# EAGLE design PCB-AC2 (EAGLE 7.7.0)

## Sheet 1 of 2
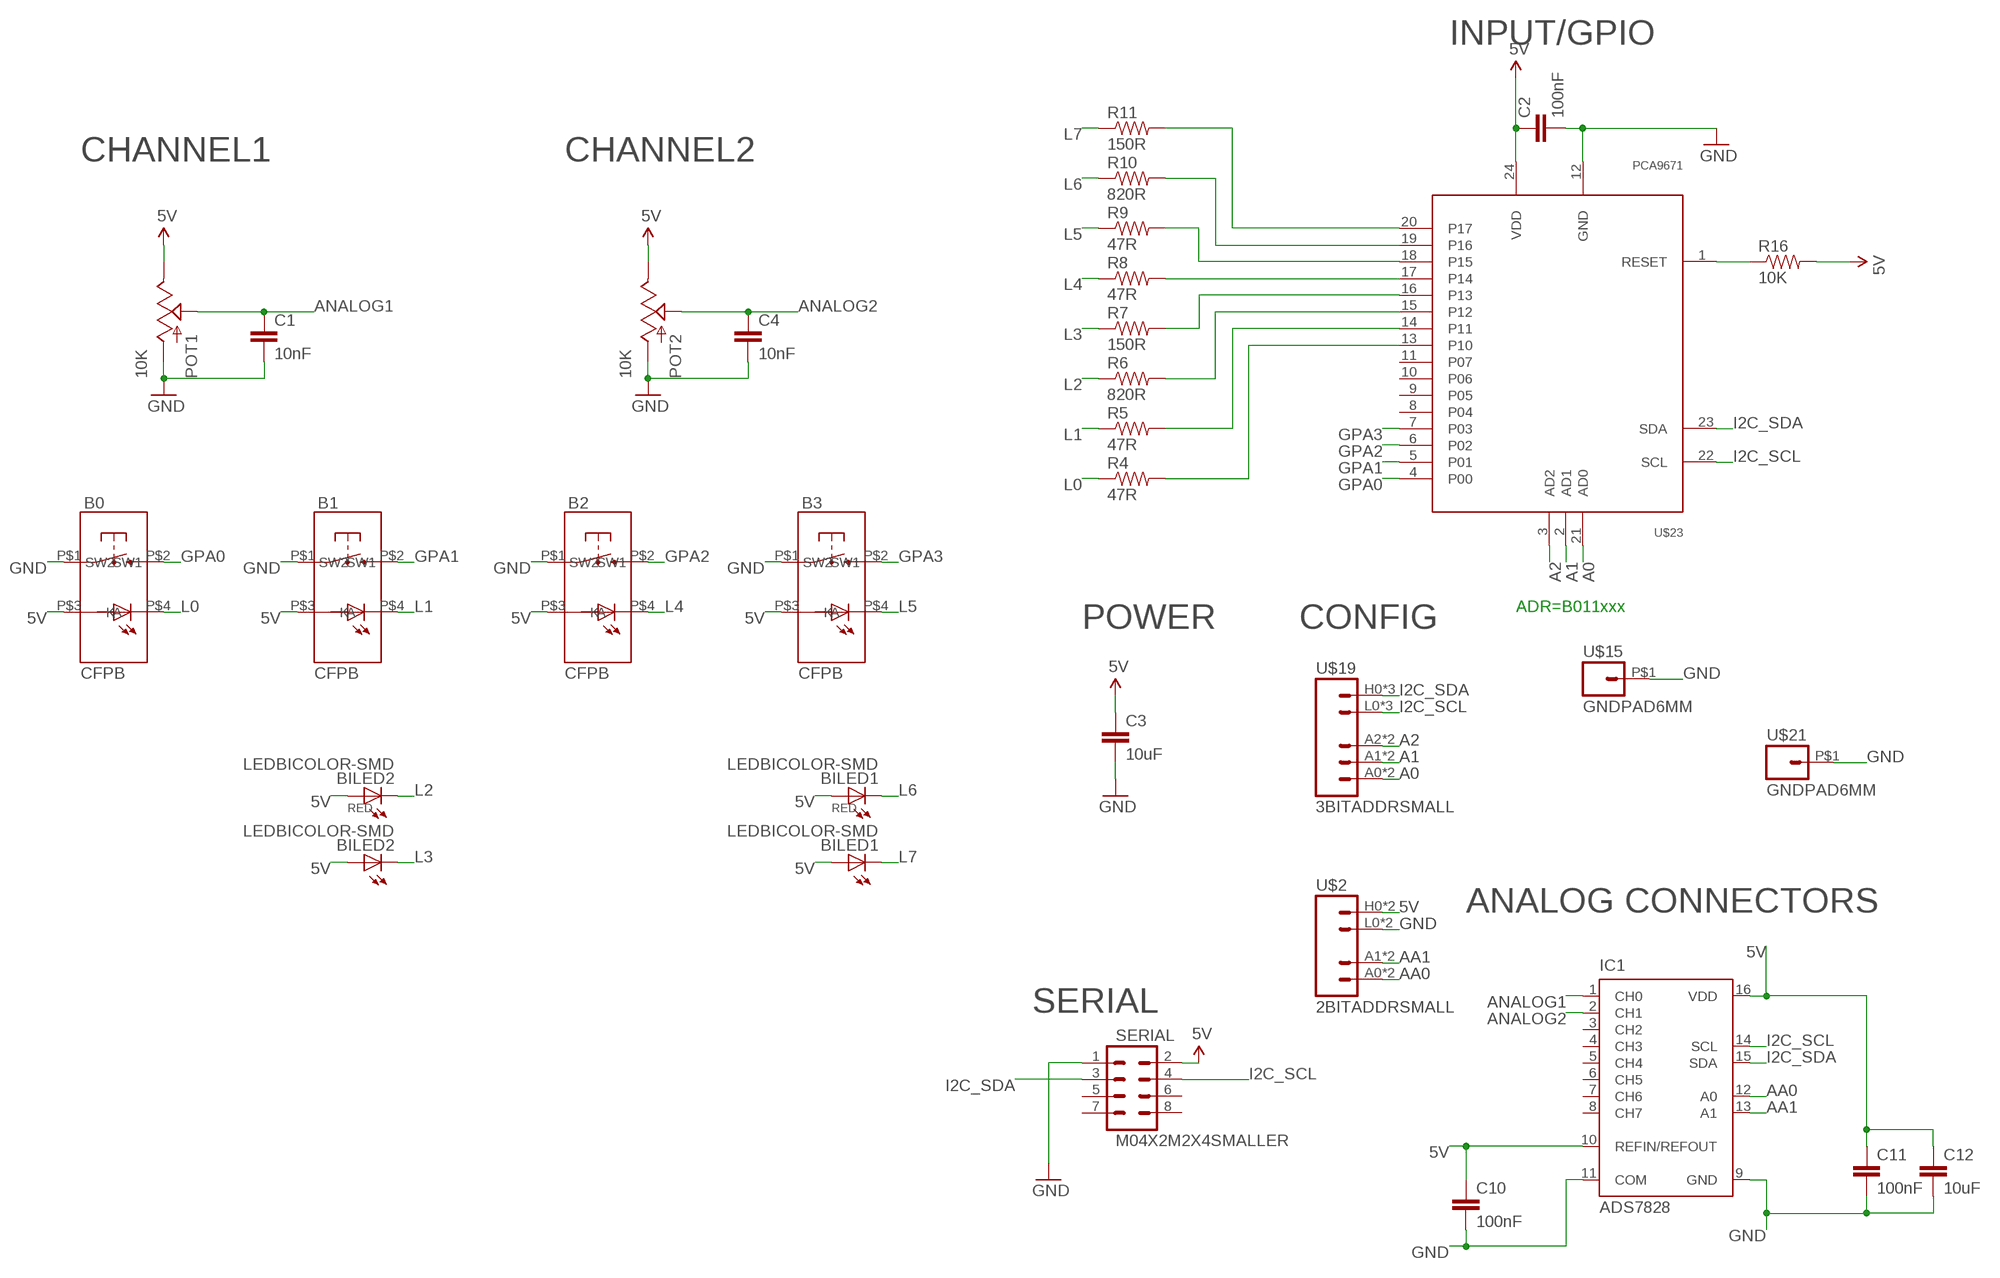
[diagram p0: schematic, sheet 1]

### Parts
B0  CFPB  [CFPB-6/9MM]
B1  CFPB  [CFPB-6/9MM]
B2  CFPB  [CFPB-6/9MM]
B3  CFPB  [CFPB-6/9MM]
BILED1  LEDBICOLOR-SMD  [LEDBICOLOR-SMD]
BILED2  LEDBICOLOR-SMD  [LEDBICOLOR-SMD]
C1  10nF  CAP0603-CAP  [0603-CAP]
C2  100nF  CAP0603-CAP  [0603-CAP]
C3  10uF  CAP0805  [0805]
C4  10nF  CAP0603-CAP  [0603-CAP]
C10  100nF  CAP0603-CAP  [0603-CAP]
C11  100nF  CAP0603-CAP  [0603-CAP]
C12  10uF  CAP0805  [0805]
IC1  ADS7828  [TSSOP16-PW]
POT1  10K  POT  [ALPS_POT]
POT2  10K  POT  [ALPS_POT]
R4  47R  RESISTOR0603-RES  [0603-RES]
R5  47R  RESISTOR0603-RES  [0603-RES]
R6  820R  RESISTOR0603-RES  [0603-RES]
R7  150R  RESISTOR0603-RES  [0603-RES]
R8  47R  RESISTOR0603-RES  [0603-RES]
R9  47R  RESISTOR0603-RES  [0603-RES]
R10  820R  RESISTOR0603-RES  [0603-RES]
R11  150R  RESISTOR0603-RES  [0603-RES]
R16  10K  RESISTOR0603-RES  [0603-RES]
SERIAL  M04X2M2X4SMALLER  [M2X4SMALLER]
U$2  2BITADDRSMALL  [2BITADDR_SMALL]
U$15  GNDPAD6MM  [3.2MMPAD6MM]
U$19  3BITADDRSMALL  [3BITADDR_SMALL]
U$21  GNDPAD6MM  [3.2MMPAD6MM]
U$23  PCA9671  [TSSOP24]

### Nets
5V [Power]: B0.P$3(A) B1.P$3(A) B2.P$3(A) B3.P$3(A) BILED1.P$1(A) BILED1.P$3(A1) BILED2.P$1(A) BILED2.P$3(A1) C2.1 C3.1 C10.1 C11.1 C12.1 IC1.10(REFIN/REFOUT) IC1.16(VDD) POT1.P$1(E) POT2.P$1(E) R16.2 SERIAL.2 U$2.H0(VCC) U$2.H1(VCC) U$23.24(VDD)
A0: U$19.A0 U$19.AS0(A0) U$23.21(AD0)
A1: U$19.A1 U$19.AS1(A1) U$23.2(AD1)
A2: U$19.A2 U$19.AS2(A2) U$23.3(AD2)
AA0: IC1.12(A0) U$2.A0(A1) U$2.AS0(A1)
AA1: IC1.13(A1) U$2.A1(A2) U$2.AS1(A2)
ANALOG1: C1.1 IC1.1(CH0) POT1.P$2(S)
ANALOG2: C4.1 IC1.2(CH1) POT2.P$2(S)
GND [Power]: B0.P$1(SW1) B1.P$1(SW1) B2.P$1(SW1) B3.P$1(SW1) C1.2 C2.2 C3.2 C4.2 C10.2 C11.2 C12.2 IC1.9(GND) IC1.11(COM) POT1.P$3(A) POT2.P$3(A) SERIAL.1 U$2.L0(GND) U$2.L1(GND) U$15.P$1 U$21.P$1 U$23.12(GND)
GPA0: B0.P$2(SW2) U$23.4(P00)
GPA1: B1.P$2(SW2) U$23.5(P01)
GPA2: B2.P$2(SW2) U$23.6(P02)
GPA3: B3.P$2(SW2) U$23.7(P03)
I2C_SCL: IC1.14(SCL) SERIAL.4 U$19.L0(GND) U$19.L1(GND) U$19.L2(GND) U$23.22(SCL)
I2C_SDA: IC1.15(SDA) SERIAL.3 U$19.H0(VCC) U$19.H1(VCC) U$19.H2(VCC) U$23.23(SDA)
L0: B0.P$4(K) R4.1
L1: B1.P$4(K) R5.1
L2: BILED2.P$2(C) R6.1
L3: BILED2.P$4(C1) R7.1
L4: B2.P$4(K) R8.1
L5: B3.P$4(K) R9.1
L6: BILED1.P$2(C) R10.1
L7: BILED1.P$4(C1) R11.1
N$2: R7.2 U$23.16(P13)
N$3: R8.2 U$23.17(P14)
N$4: R9.2 U$23.18(P15)
N$5: R10.2 U$23.19(P16)
N$6: R11.2 U$23.20(P17)
N$7: R6.2 U$23.15(P12)
N$8: R5.2 U$23.14(P11)
N$9: R4.2 U$23.13(P10)
N$22: R16.1 U$23.1(RESET)
Unconnected: IC1.3(CH2) IC1.4(CH3) IC1.5(CH4) IC1.6(CH5) IC1.7(CH6) IC1.8(CH7) SERIAL.5 SERIAL.6 SERIAL.7 SERIAL.8 U$23.8(P04) U$23.9(P05) U$23.10(P06) U$23.11(P07)

### Notes on the sheet
- INPUT/GPIO
- CHANNEL1 | CHANNEL2
- ADR=B011xxx
- POWER | CONFIG
- ANALOG CONNECTORS
- SERIAL

## Sheet 2 of 2

## Library data of the parts
B0 B1-B3 = SKAARHOJ:CFPB
BILED1 BILED2 = SKAARHOJ:LEDBICOLOR-SMD
C1-C4 C10-C12 = SparkFun:CAP: Capacitor Standard 0603 ceramic capacitor, and 0.1" leaded capacitor.
IC1 = burr-brown:ADS7828: 12-Bit, 8-Channel Sampling ANALOG-TO-DIGITAL CONVERTER with I2C? Interface Source: www.ti.com .. ADS7828.pdf; MF: TEXAS INSTRUMENTS; MPN: ADS7828E/250; OC_FARNELL: 1470338; OC_NEWARK: 74C7158
POT1 POT2 = SparkFun:POT
R4-R11 R16 = SparkFun:RESISTOR: Resistor Basic schematic elements and footprints for 0603, 1206, and PTH resistors.
SERIAL = SKAARHOJ:M04X2
U$2 = SKAARHOJ:2BITADDR
U$15 U$21 = SKAARHOJ:GNDPAD
U$19 = SKAARHOJ:3BITADDR
U$23 = SKAARHOJ:PCA9671

## Net classes
0 default: width 0.203 mm, drill 0.406 mm, clearance 0.203 mm
1 Power: width 0.406 mm, drill 0.61 mm, clearance 0.203 mm
2 Signal: width 0.152 mm, clearance 0.152 mm

## Board
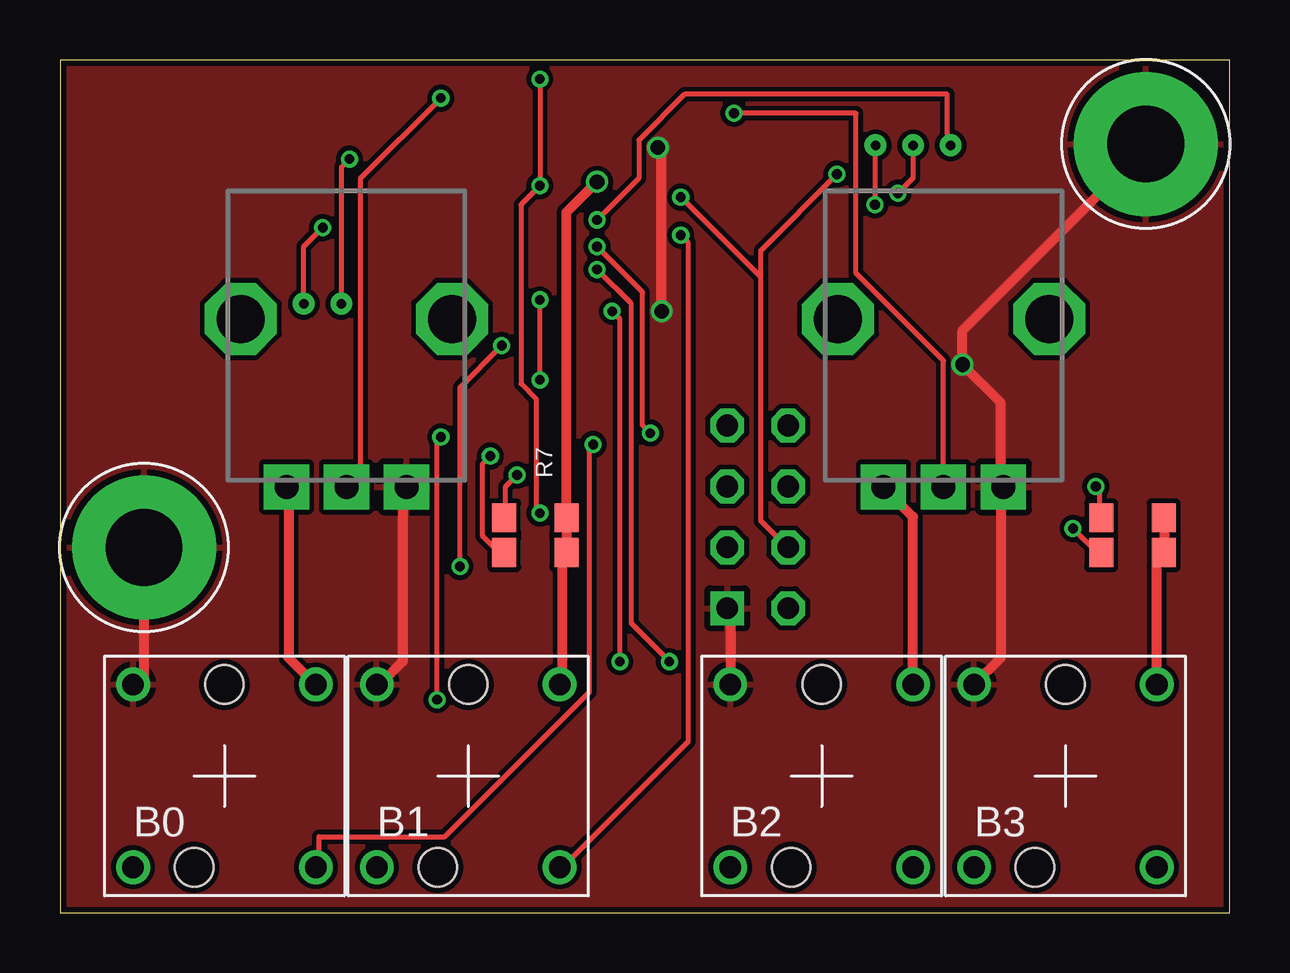
[diagram p1: board, top side]
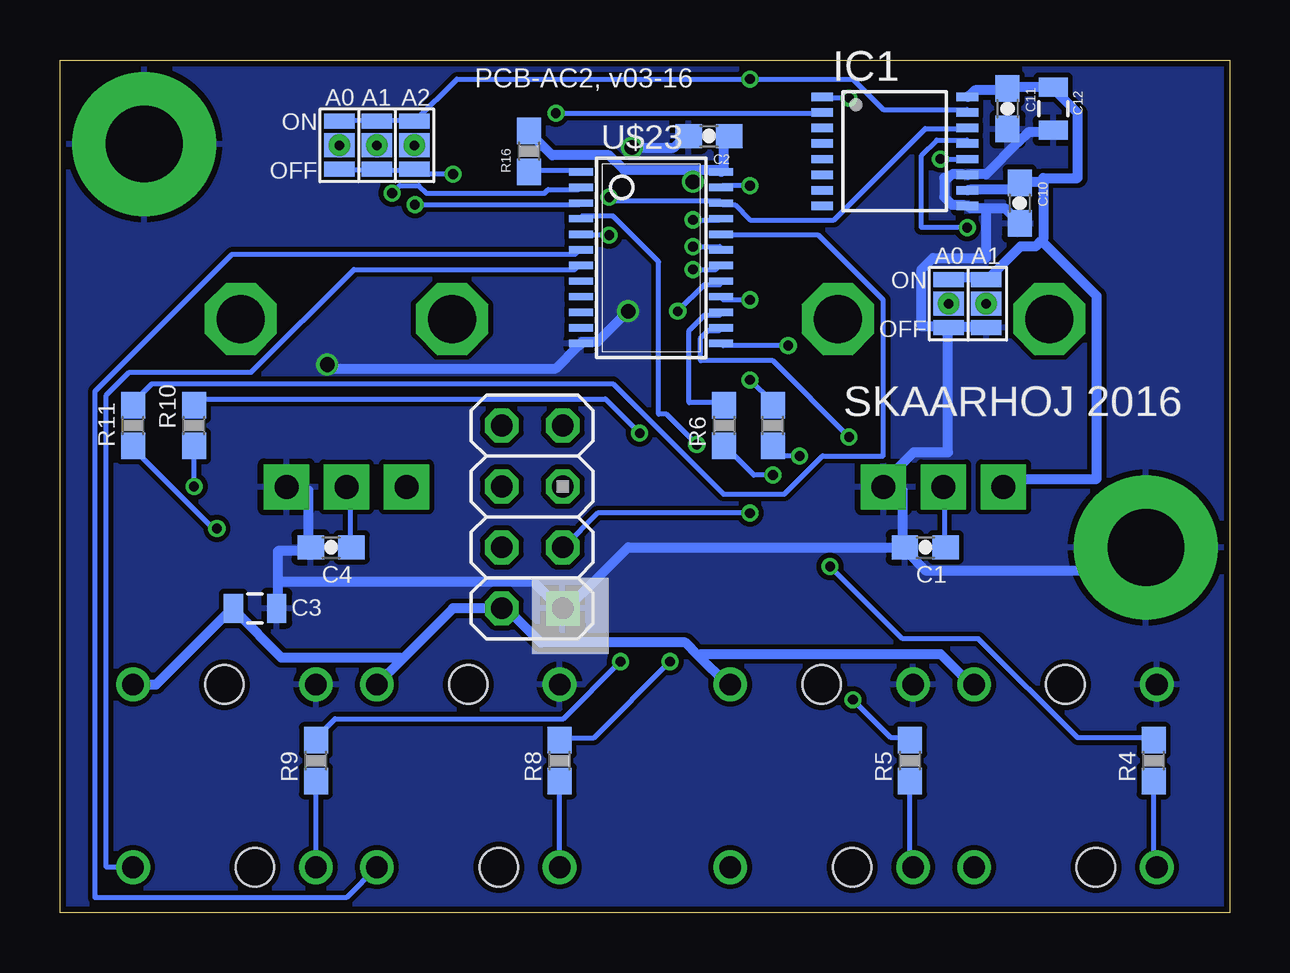
[diagram p2: board, bottom side, seen from below]

Size 48.77 x 35.56 mm. Coordinates in mm from the lower left corner, seen from the top.
Outline: 0,0 48.77,0 48.77,35.56 0,35.56 0,0
Copper layers (1*16): Top 0.035mm / dielectric 1.5mm / Bottom 0.035mm
Design rules "Fusion_eagle_rule_v1.1": minimum track width 6mil, minimum drill 12mil, track to track 6mil, track to pad 6mil, pad to pad 6mil, via to via 6mil, smd to smd 0mil, copper to edge 10mil, drill to drill 10mil, minimum pad ring 10mil, minimum via ring 6mil, stop-mask expansion 2mil, vias tented up to drill 100mil, thermal gap 10mil

### Footprints (pad centres in the part's own frame; a part is rotated, then mirrored left to right if it is on the bottom)
CFPB-6/9MM = drill 0.9: P$1 -3.81,3.81; P$2 3.81,-3.81; P$3 3.81,3.81; P$4 -3.81,-3.81 | hole 1.6: 0,3.81; -1.27,-3.81
LEDBICOLOR-SMD = smd 1 x 1.2: P$1 1.3,0.725; P$2 -1.3,0.725; P$3 1.3,-0.725; P$4 -1.3,-0.725
0603-CAP = smd 1.1 x 1: 1 -0.85,0; 2 0.85,0
0805 = smd 0.8 x 1.2: 1 -0.9,0; 2 0.9,0
TSSOP16-PW = smd 0.35 x 0.9: 1 -2.275,-3.025; 2 -1.625,-3.025; 3 -0.975,-3.025; 4 -0.325,-3.025; 5 0.325,-3.025; 6 0.975,-3.025; 7 1.625,-3.025; 8 2.275,-3.025; 9 2.275,3.025; 10 1.625,3.025; 11 0.975,3.025; 12 0.325,3.025; 13 -0.325,3.025; 14 -0.975,3.025; 15 -1.625,3.025; 16 -2.275,3.025
ALPS_POT = drill 1 pad 1.88 square: P$1 7,-2.5; P$2 7,0; P$3 7,2.5 | drill 2 octagon: P$4 0,-4.4; P$5 0,4.4
0603-RES = smd 1.1 x 1: 1 -0.85,0; 2 0.85,0
M2X4SMALLER = drill 0.9 square: 1 -1.27,3.81 | drill 0.9 octagon: 2 1.27,3.81; 3 -1.27,1.27; 4 1.27,1.27; 5 -1.27,-1.27; 6 1.27,-1.27; 7 -1.27,-3.81; 8 1.27,-3.81
2BITADDR_SMALL = drill 0.4: A0 -1.565,0; A1 0,0 | smd 1.27 x 1: AS0 -1.565,0; AS1 0,0 | smd 1.27 x 0.635: H0 -1.565,1; H1 0,1; L0 -1.565,-1; L1 0,-1
3.2MMPAD6MM = drill 3.2 pad 6: P$1 0,0
3BITADDR_SMALL = drill 0.4: A0 -1.565,0; A1 0,0; A2 1.565,0 | smd 1.27 x 1: AS0 -1.565,0; AS1 0,0; AS2 1.565,0 | smd 1.27 x 0.635: H0 -1.565,1; H1 0,1; H2 1.565,1; L0 -1.565,-1; L1 0,-1; L2 1.565,-1
TSSOP24 = smd 0.305 x 0.991: 1 -4.225,-2.918; 2 -3.575,-2.918; 3 -2.925,-2.918; 4 -2.275,-2.918; 5 -1.625,-2.918; 6 -0.975,-2.918; 7 -0.325,-2.918; 8 0.325,-2.918; 9 0.975,-2.918; 10 1.625,-2.918; 11 2.275,-2.918; 12 2.925,-2.918; 13 2.925,2.918; 14 2.275,2.918; 15 1.625,2.918; 16 0.975,2.918; 17 0.325,2.918; 18 -0.325,2.918; 19 -0.975,2.918; 20 -1.625,2.918; 21 -2.275,2.918; 22 -2.925,2.918; 23 -3.575,2.918; 24 -4.225,2.918

### Placement (x,y rotation side)
B0  6.86,5.71 0 top
B1  17.02,5.71 0 top
B2  31.75,5.71 0 top
B3  41.91,5.71 0 top
BILED1  44.7,15.75 0 top
BILED2  19.81,15.75 0 top
C1  12.7,15.24 180 bottom
C2  21.72,32.38 180 bottom
C3  40.64,12.7 0 bottom
C4  37.47,15.24 180 bottom
C10  8.76,29.59 270 bottom
C11  9.27,33.53 270 bottom
C12  7.37,33.53 270 bottom
IC1  13.97,31.75 270 bottom
POT1  11.94,24.77 270 top
POT2  36.83,24.77 270 top
R4  3.17,6.35 90 bottom
R5  13.34,6.35 90 bottom
R6  21.08,20.32 90 bottom
R7  19.05,20.32 90 bottom
R8  27.94,6.35 90 bottom
R9  38.1,6.35 90 bottom
R10  43.18,20.32 90 bottom
R11  45.72,20.32 90 bottom
R16  29.21,31.75 90 bottom
SERIAL  29.08,16.51 180 bottom
U$2  10.16,25.4 0 bottom
U$15  3.5,15.24 0 top
U$19  35.56,32 0 bottom
U$21  45.26,32.06 0 top
U$23  24.13,26.67 270 bottom

### Tracks (layer width: path | path; a pad name or v marks a point on that pad's centre or on a via)
5V  (via drill 0.61)
  Top 0.406: B0.P$3 10.64,9.53 9.53,10.64 9.53,17.62 POT1.P$1 | BILED1.P$1 46.04,16.35 46.04,15.08 BILED1.P$3 45.88,14.92 45.72,14.76 B3.P$3 | B2.P$3 35.56,16.51 34.45,17.62 POT2.P$1 | B1.P$3 20.95,9.53 20.95,14.92 BILED2.P$3 21.11,15.08 21.11,16.35 BILED2.P$1 21.11,16.67 21.11,29.21 v22.38,30.48
  Bottom 0.406: IC1.16 10.79,34.13 10.64,34.29 9.37,34.29 C11.1 9.21,34.45 7.46,34.45 C12.1 7.3,34.29 6.35,33.34 6.35,30.64 7.78,30.64 7.78,30.48 | U$2.H0 11.59,26.51 10.16,26.51 U$2.H1 10,26.51 8.73,27.78 8.1,27.78 7.86,28.02 | IC1.10 10.79,30.16 9.05,30.16 8.89,30.32 C10.1 8.57,30.48 7.78,30.48 | 7.86,28.02 7.78,28.1 7.78,30.48 | 7.86,28.02 5.56,25.72 5.56,18.1 9.05,18.1 9.37,17.78 POT1.P$1 | B3.P$3 44.77,9.53 41.59,12.7 C3.1 41.43,12.54 39.53,10.64 34.61,10.64 34.53,10.56 | 34.53,10.56 32.38,12.7 SERIAL.2 30.16,12.7 28.73,11.27 22.7,11.27 22.15,10.72 | 34.53,10.56 B2.P$3 | C2.1 21.11,32.38 21.11,30.96 U$23.24 21.27,30.96 22.38,30.96 | 22.38,30.96 25.24,30.96 25.88,31.59 28.26,31.59 29.21,32.54 R16.2 | v22.38,30.48 22.38,30.96 | 22.15,10.72 20.95,9.53 B1.P$3 | B0.P$3 10.79,9.53 12.06,10.79 22.07,10.79 22.15,10.72
A0  (via drill 0.41)
  Top 0.203: v22.38,28.89 24.13,30.64 24.13,32.23 26.04,34.13 36.99,34.13 36.99,32.07 U$19.AS0
  Bottom 0.203: v22.38,28.89 21.27,28.89 U$23.21 | 37.15,32.07 U$19.AS0
A1  (via drill 0.41)
  Top 0.203: v34.92,30 35.56,30.64 U$19.AS1
  Bottom 0.203: v34.92,30 34.61,30.32 33.81,30.32 33.5,30 28.57,30 28.42,30.16 27.15,30.16 U$23.2 | 35.56,32.07 U$19.AS1
A2  (via drill 0.41)
  Top 0.203: v33.97,29.53 33.97,31.91 U$19.AS2
  Bottom 0.203: v33.97,29.53 27.15,29.53 U$23.3 | 34.13,32.07 U$19.AS2
AA0  (via drill 0.41)
  Top 0.203: v12.06,31.43 11.75,31.11 11.75,25.4 U$2.A0
  Bottom 0.203: v12.06,31.43 IC1.12 | 11.75,25.4 U$2.A0
AA1  (via drill 0.41)
  Top 0.203: v10.95,28.57 10.16,27.78 U$2.A1
  Bottom 0.203: v10.95,28.57 12.86,28.57 12.86,31.59 12.22,32.23 10.95,32.23 IC1.13
ANALOG1  (via drill 0.41)
  Top 0.203: v15.88,33.97 12.54,30.64 12.54,18.26 12.06,17.78 POT1.P$2
  Bottom 0.203: v15.88,33.97 16.99,33.97 IC1.1 | C1.1 11.91,15.24 11.91,17.62 POT1.P$2
ANALOG2  (via drill 0.41)
  Top 0.203: v28.1,33.34 33.18,33.34 33.18,26.67 36.83,23.02 POT2.P$2
  Bottom 0.203: v28.1,33.34 17.14,33.34 IC1.2 | C4.1 36.67,15.24 36.67,17.62 36.83,17.62 POT2.P$2
GND  (via drill 0.61)
  Top 0.406: B0.P$1 3.17,9.53 3.49,9.84 U$15.P$1 | B1.P$1 13.34,9.53 14.29,10.48 14.29,17.62 POT1.P$3 | B2.P$1 27.94,12.7 SERIAL.1 | v24.92,31.91 25.08,31.75 v25.08,25.08 | B3.P$1 39.21,10.64 39.21,17.62 POT2.P$3 39.21,17.78 39.21,21.27 v37.62,22.86 37.62,24.29 45.24,31.91 U$21.P$1
  Bottom 0.406: 10.16,29.37 9.37,29.37 8.89,28.89 C10.2 | 10.16,29.37 10.79,29.37 IC1.9 11.11,29.53 11.59,29.53 11.91,29.84 11.91,30.64 11.75,30.64 11.59,30.8 11.11,30.8 IC1.11 10.79,30.8 10.16,30.8 8.81,32.15 | 8.81,32.15 8.41,32.54 7.46,32.54 C12.2 | 8.81,32.15 9.21,32.54 C11.2 | U$2.L1 10.16,24.45 11.59,24.45 U$2.L0 | C1.2 13.65,15.24 13.65,17.62 14.29,17.62 POT1.P$3 14.45,17.94 13.18,19.21 11.75,19.21 11.75,24.29 U$2.L0 | 10.16,29.37 10.16,27.3 12.38,27.3 12.86,26.83 12.86,24.45 11.91,24.45 U$2.L0 | U$15.P$1 3.65,15.24 4.6,14.29 12.7,14.29 13.49,15.08 C1.2 | v37.62,22.86 37.47,22.7 28.1,22.7 27.15,23.65 U$23.12 26.99,23.81 26.35,23.81 v25.08,25.08 | POT2.P$3 39.21,17.62 38.42,17.62 38.42,15.24 C4.2 38.42,15.08 39.69,15.08 39.69,13.81 | v24.92,31.91 23.18,31.91 22.7,32.38 C2.2 | 39.69,13.81 39.69,12.7 C3.2 | 39.69,13.81 29.05,13.81 27.94,12.7 SERIAL.1 27.62,12.7 25.08,15.24 C1.2
  pour Top: 0,0 49.53,0 49.53,35.56 0,35.56
  pour Bottom: 0,0 49.53,0 49.53,35.56 0,35.56
GPA0  (via drill 0.41)
  Top 0.203: v22.23,19.53 22.07,19.37 22.07,9.21 16.03,3.17 10.79,3.17 10.79,1.91 B0.P$2
  Bottom 0.203: v22.23,19.53 23.5,20.8 23.81,20.8 23.81,27.15 25.72,29.05 26.99,29.05 U$23.4
GPA1  (via drill 0.41)
  Top 0.203: v25.88,28.26 26.19,27.94 26.19,7.14 20.95,1.91 B1.P$2
  Bottom 0.203: v25.88,28.26 26.99,28.26 U$23.5
GPA2
  Bottom 0.203: B2.P$2 36.83,0.64 47.31,0.64 47.31,21.75 41.59,27.46 27.3,27.46 27.15,27.62 U$23.6
GPA3
  Bottom 0.203: B3.P$2 46.83,1.91 46.83,21.59 45.88,22.54 40.8,22.54 36.51,26.83 27.3,26.83 27.15,26.99 U$23.7
I2C_SCL  (via drill 0.41)
  Top 0.203: v32.38,30.8 29.21,27.62 29.21,26.51 | 29.21,26.51 29.21,16.35 30.32,15.24 SERIAL.4 | 29.21,26.51 v25.88,29.84
  Bottom 0.203: IC1.14 10.95,32.7 12.7,32.7 16.51,28.89 20,28.89 20.64,29.53 21.11,29.53 U$23.22 21.27,29.69 25.72,29.69 v25.88,29.84 | 35.56,30.96 34.13,30.96 U$19.L2 33.97,30.96 33.81,30.8 v32.38,30.8 | 35.56,30.96 36.99,30.96 U$19.L0 | 35.56,30.96 U$19.L1
I2C_SDA  (via drill 0.41)
  Top 0.203: v20,34.77 v20,30.32 19.21,29.53 19.21,22.07 19.84,21.43 19.84,16.83 v20,16.67
  Bottom 0.203: IC1.15 10.95,33.5 14.45,33.5 15.72,34.77 v20,34.77 32.23,34.77 33.97,33.02 U$19.H2 34.13,33.02 35.56,33.02 | v20,30.32 21.11,30.32 U$23.23 | 35.56,33.02 36.99,33.02 U$19.H0 | 35.56,33.02 U$19.H1 | v20,16.67 26.35,16.67 27.78,15.24 SERIAL.3
L0
  Bottom 0.203: R4.1 3.17,1.91 B0.P$4
L1
  Bottom 0.203: R5.1 13.34,1.91 B1.P$4
L2  (via drill 0.41)
  Top 0.203: v19.05,18.26 18.57,17.78 18.57,16.51 BILED2.P$2
  Bottom 0.203: v19.05,18.26 19.84,18.26 20.95,19.37 R6.1
L3  (via drill 0.41)
  Top 0.203: v17.94,19.05 17.62,18.73 17.62,15.72 18.41,14.92 BILED2.P$4
  Bottom 0.203: v17.94,19.05 18.73,19.05 19.05,19.37 R7.1
L4
  Bottom 0.203: B2.P$4 R8.1
L5
  Bottom 0.203: B3.P$4 R9.1
L6  (via drill 0.41)
  Top 0.203: v43.18,17.78 43.34,17.62 43.34,16.51 BILED1.P$2
  Bottom 0.203: v43.18,17.78 R10.1
L7  (via drill 0.41)
  Top 0.203: v42.23,16.03 43.34,14.92 BILED1.P$4
  Bottom 0.203: v42.23,16.03 42.39,16.03 45.72,19.37 R11.1
N$2  (via drill 0.41)
  Top 0.203: v20,22.23 v20,25.56
  Bottom 0.203: v20,25.56 21.11,25.56 U$23.16 | v20,22.23 19.05,21.27 R7.2
N$3  (via drill 0.41)
  Top 0.203: v23.02,25.08 23.34,24.77 v23.34,10.48
  Bottom 0.203: v23.02,25.08 21.91,26.19 21.27,26.19 U$23.17 | v23.34,10.48 26.51,7.3 27.94,7.3 R8.2
N$4  (via drill 0.41)
  Top 0.203: v22.38,26.83 23.81,25.4 23.81,12.06 v25.4,10.48
  Bottom 0.203: v22.38,26.83 21.43,26.83 21.27,26.99 U$23.18 | v25.4,10.48 27.78,8.1 37.31,8.1 38.1,7.3 R9.2
N$5  (via drill 0.41)
  Top 0.203: v22.38,27.78 24.29,25.88 24.29,20.32 v24.61,20
  Bottom 0.203: v22.38,27.78 21.27,27.78 U$23.19 | v24.61,20 26.04,21.43 43.02,21.43 43.18,21.27 R10.2
N$6
  Bottom 0.203: U$23.20 21.11,28.26 17.14,28.26 14.45,25.56 14.45,19.05 16.99,19.05 18.57,17.46 21.11,17.46 25.72,22.07 44.93,22.07 45.72,21.27 R11.2
N$7
  Bottom 0.203: U$23.15 21.27,24.92 21.91,24.92 22.54,24.29 22.54,21.27 21.11,21.27 R6.2
N$8  (via drill 0.41)
  Top 0.203: v15.88,19.84 15.72,19.68 v15.72,8.89
  Bottom 0.203: v15.88,19.84 19.05,23.02 22.07,23.02 22.07,23.97 21.75,24.29 21.27,24.29 U$23.14 | v15.72,8.89 14.13,7.3 13.34,7.3 R5.2
N$9  (via drill 0.41)
  Top 0.203: v18.41,23.65 16.67,21.91 v16.67,14.45
  Bottom 0.203: v18.41,23.65 21.11,23.65 U$23.13 | v16.67,14.45 13.65,11.43 10.48,11.43 6.35,7.3 3.17,7.3 R4.2
N$22
  Bottom 0.203: U$23.1 27.15,30.96 29.21,30.96 R16.1

### Text on the board
_bsilk: PCB-AC2, v03-16 | SKAARHOJ 2016